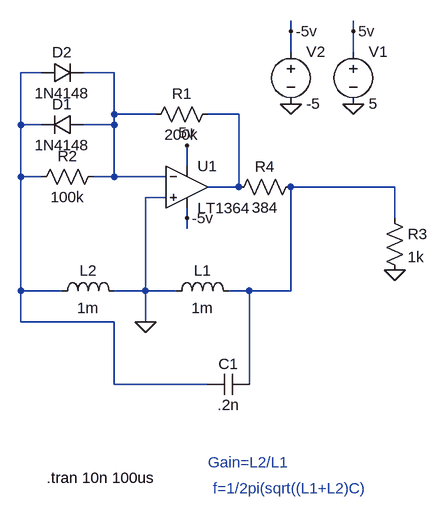
[diagram p0: schematic Draft1.asc]
Draft1.asc, the LTspice schematic file:
Version 4
SHEET 1 880 680
WIRE 112 -368 112 -384
WIRE 208 -368 208 -384
WIRE 112 -336 112 -368
WIRE 208 -336 208 -368
WIRE -272 -304 -304 -304
WIRE -160 -304 -208 -304
WIRE -160 -240 -160 -304
WIRE -96 -240 -160 -240
WIRE 32 -240 -16 -240
WIRE -304 -224 -304 -304
WIRE -272 -224 -304 -224
WIRE -160 -224 -160 -240
WIRE -160 -224 -208 -224
WIRE -48 -160 -48 -192
WIRE -304 -144 -304 -224
WIRE -272 -144 -304 -144
WIRE -160 -144 -160 -224
WIRE -160 -144 -192 -144
WIRE -80 -144 -160 -144
WIRE 32 -128 32 -240
WIRE 32 -128 -16 -128
WIRE 272 -128 112 -128
WIRE -80 -112 -112 -112
WIRE -48 -80 -48 -96
WIRE 272 -80 272 -128
WIRE -48 -64 -48 -80
WIRE -304 32 -304 -144
WIRE -240 32 -304 32
WIRE -112 32 -112 -112
WIRE -112 32 -160 32
WIRE -64 32 -112 32
WIRE 48 32 16 32
WIRE 112 32 112 -128
WIRE 112 32 48 32
WIRE -304 80 -304 32
WIRE -160 80 -304 80
WIRE -112 80 -112 32
WIRE -160 176 -160 80
WIRE -16 176 -160 176
WIRE 48 176 48 32
FLAG 208 -256 0
FLAG 208 -368 5v
FLAG 112 -256 0
FLAG 112 -368 -5v
FLAG 272 0 0
FLAG -48 -192 5v
FLAG -112 80 0
FLAG -48 -80 -5v
SYMBOL Voltage 208 -352 R0
SYMATTR InstName V1
SYMATTR Value 5
SYMBOL Voltage 112 -352 R0
SYMATTR InstName V2
SYMATTR Value -5
SYMBOL Res 0 -256 R90
WINDOW 0 0 56 VBottom 2
WINDOW 3 32 56 VTop 2
SYMATTR InstName R1
SYMATTR Value 200k
SYMBOL Res -176 -160 R90
WINDOW 0 0 56 VBottom 2
WINDOW 3 32 56 VTop 2
SYMATTR InstName R2
SYMATTR Value 100k
SYMBOL Res 256 -96 R0
SYMATTR InstName R3
SYMATTR Value 1k
SYMBOL OpAmps/LT1364 -48 -192 R0
SYMATTR InstName U1
SYMBOL ind -80 48 R270
WINDOW 0 32 56 VTop 2
WINDOW 3 5 56 VBottom 2
SYMATTR InstName L1
SYMATTR Value 1m
SYMBOL ind -256 48 R270
WINDOW 0 32 56 VTop 2
WINDOW 3 5 56 VBottom 2
SYMATTR InstName L2
SYMATTR Value 1m
SYMBOL diode -208 -240 R90
WINDOW 0 0 32 VBottom 2
WINDOW 3 32 32 VTop 2
SYMATTR InstName D1
SYMATTR Value 1N4148
SYMBOL diode -272 -288 R270
WINDOW 0 32 32 VTop 2
WINDOW 3 0 32 VBottom 2
SYMATTR InstName D2
SYMATTR Value 1N4148
SYMBOL Cap 48 160 R90
WINDOW 0 0 32 VBottom 2
WINDOW 3 32 32 VTop 2
SYMATTR InstName C1
SYMATTR Value .2n
SYMBOL Res 128 -144 R90
WINDOW 0 0 56 VBottom 2
WINDOW 3 32 56 VTop 2
SYMATTR InstName R4
SYMATTR Value 384
TEXT -16 296 Left 2 ;Gain=L2/L1
TEXT -8 336 Left 2 ;f=1/2pi(sqrt((L1+L2)C)
TEXT -264 320 Left 2 !.tran 10n 100us

The netlist it stands for:
* Draft1.asc
V1 5v 0 5
V2 -5v 0 -5
R1 N003 N002 200k
R2 N002 N001 100k
R3 N004 0 1k
XU1 0 N002 5v -5v N003 LT1363  ; LT1364, pins In+ In- V+ V- OUT
L1 0 N004 1m
L2 N001 0 1m
D1 N002 N001 1N4148
D2 N001 N002 1N4148
C1 N004 N001 .2n
R4 N004 N003 384
.model D D
.lib standard.dio
* Gain=L2/L1
* f=1/2pi(sqrt((L1+L2)C)
.tran 10n 100us
.lib LTC.lib
.backanno
.end